# EAGLE design shield_ard (EAGLE 9.5.2)
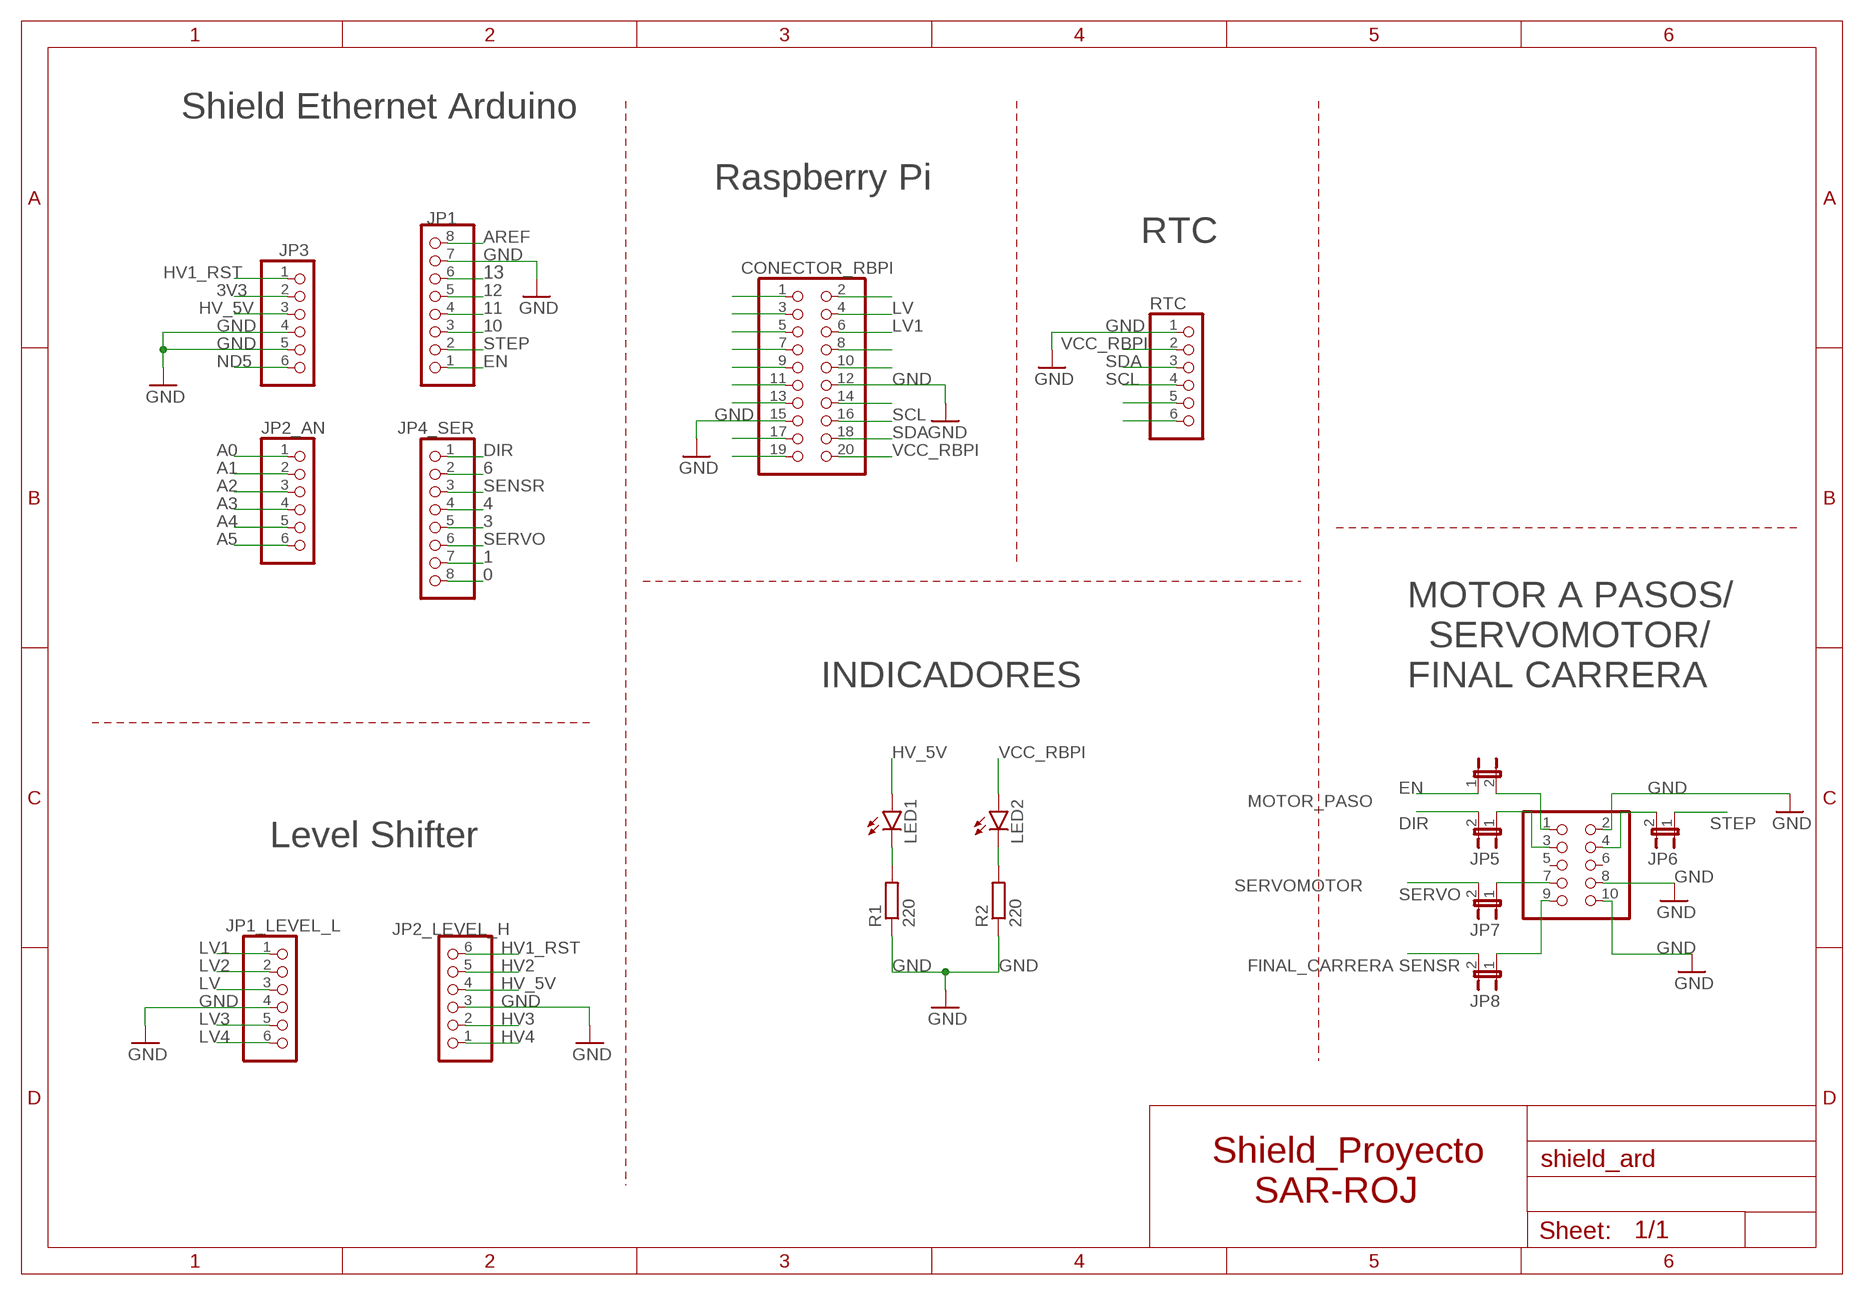
[diagram p0: schematic, sheet 1]

## Parts
CONECTOR_RBPI  PINHD-2X10  [2X10]
JP1  PINHD-1X8  [1X08]
JP1_LEVEL_L  PINHD-1X6  [1X06]
JP2  JUMPER-2PTH  [1X02]
JP2_AN  PINHD-1X6  [1X06]
JP2_LEVEL_H  PINHD-1X6  [1X06]
JP3  PINHD-1X6  [1X06]
JP4_SER  PINHD-1X8  [1X08]
JP5  JUMPER-2PTH  [1X02]
JP6  JUMPER-2PTH  [1X02]
JP7  JUMPER-2PTH  [1X02]
JP8  JUMPER-2PTH  [1X02]
LED1  LEDCHIP-LED0805  [CHIP-LED0805]
LED2  LEDCHIP-LED0805  [CHIP-LED0805]
MOTOR_PASO  PINHD-2X5  [2X05]
R1  220  R-EU_R0805  [R0805]
R2  220  R-EU_R0805  [R0805]
RTC  PINHD-1X6/90  [1X06/90]

## Nets
0: JP4_SER.8
1: JP4_SER.7
3: JP4_SER.5
3V3: JP3.2
4: JP4_SER.4
6: JP4_SER.2
10: JP1.3
11: JP1.4
12: JP1.5
13: JP1.6
A0: JP2_AN.1
A1: JP2_AN.2
A2: JP2_AN.3
A3: JP2_AN.4
A4: JP2_AN.5
A5: JP2_AN.6
AREF: JP1.8
DIR: JP4_SER.1 JP5.1 JP5.2 MOTOR_PASO.3
EN: JP1.1 JP2.1 JP2.2 MOTOR_PASO.1
GND: CONECTOR_RBPI.12 CONECTOR_RBPI.15 JP1.7 JP1_LEVEL_L.4 JP2_LEVEL_H.3 JP3.4 JP3.5 MOTOR_PASO.2 MOTOR_PASO.8 MOTOR_PASO.10 R1.1 R2.1 RTC.1
HV1_RST: JP2_LEVEL_H.6 JP3.1
HV2: JP2_LEVEL_H.5
HV3: JP2_LEVEL_H.2
HV4: JP2_LEVEL_H.1
HV_5V: JP2_LEVEL_H.4 JP3.3 LED1.A
LV: CONECTOR_RBPI.4 JP1_LEVEL_L.3
LV1: CONECTOR_RBPI.6 JP1_LEVEL_L.1
LV2: JP1_LEVEL_L.2
LV3: JP1_LEVEL_L.5
LV4: JP1_LEVEL_L.6
N$2: LED1.C R1.2
N$3: LED2.C R2.2
N$6: JP6.2 MOTOR_PASO.4
N$7: JP7.1 MOTOR_PASO.7
N$17: CONECTOR_RBPI.2
N$19: CONECTOR_RBPI.1
N$20: CONECTOR_RBPI.3
N$21: CONECTOR_RBPI.5
N$22: CONECTOR_RBPI.7
N$23: CONECTOR_RBPI.9
N$24: CONECTOR_RBPI.11
N$25: CONECTOR_RBPI.13
N$27: CONECTOR_RBPI.17
N$28: CONECTOR_RBPI.19
N$30: CONECTOR_RBPI.8
N$31: CONECTOR_RBPI.10
N$33: CONECTOR_RBPI.14
N$41: RTC.5
N$42: RTC.6
ND5: JP3.6
SCL: CONECTOR_RBPI.16 RTC.4
SDA: CONECTOR_RBPI.18 RTC.3
SENSR: JP4_SER.3 JP8.1 JP8.2 MOTOR_PASO.9
SERVO: JP4_SER.6 JP7.2
STEP: JP1.2 JP6.1
VCC_RBPI: CONECTOR_RBPI.20 LED2.A RTC.2
Unconnected: MOTOR_PASO.5 MOTOR_PASO.6

## Notes on the sheet
- Shield Ethernet Arduino
- Raspberry Pi
- RTC
- INDICADORES
- MOTOR A PASOS/
    SERVOMOTOR/ 
  FINAL CARRERA
- Level Shifter
- SERVOMOTOR
- FINAL_CARRERA
- Shield_Proyecto 
      SAR-ROJ

## Library data of the parts
CONECTOR_RBPI = pinhead:PINHD-2X10: PIN HEADER
JP1 JP4_SER = pinhead:PINHD-1X8: PIN HEADER
JP1_LEVEL_L JP2_AN JP2_LEVEL_H JP3 RTC = pinhead:PINHD-1X6: PIN HEADER
JP2 JP5-JP8 = SparkFun-Retired:JUMPER-2: Jumper Basic 0.1" spaced jumper. Use with breakaway headers.
LED1 LED2 = led:LED: LED OSRAM: - CHIPLED LG R971, LG N971, LY N971, LG Q971, LY Q971, LO R971, LY R971 LH N974, LH R974 LS Q976, LO Q976, LY Q976 LO Q996 - Hyper CHIPLED LW Q18S LB Q993, LB Q99A, LB R99A - SideLED LS A670, LO A670, LY A670, LG A670, LP A670 LB A673, LV A673, LT A673, LW A673 LH A674 LY A675 LS A676, LA A676, LO A676, LY A676, LW A676 LS A679, LY A679, LG A679 - Hyper Micro SIDELED® LS Y876, LA Y876, LO Y876, LY Y876 LT Y87S - SmartLED LW L88C, LW L88S LB L89C, LB L89S, LG L890 LS L89K, LO L89K, LY L89K LS L896, LA L896, LO L896, LY L896 - TOPLED LS T670, LO T670, LY T670, LG T670, LP T670 LSG T670, LSP T670, LSY T670, LOP T670, LYG T670 LG T671, LOG T671, LSG T671 LB T673, LV T673, LT T673, LW T673 LH T674 LS T676, LA T676, LO T676, LY T676, LB T676, LH T676, LSB T676, LW T676 LB T67C, LV T67C, LT T67C, LS T67K, LO T67K, LY T67K, LW E67C LS E67B, LA E67B, LO E67B, LY E67B, LB E67C, LV E67C, LT E67C LW T67C LS T679, LY T679, LG T679 LS T770, LO T770, LY T770, LG T770, LP T770 LB T773, LV T773, LT T773, LW T773 LH T774 LS E675, LA E675, LY E675, LS T675 LS T776, LA T776, LO T776, LY T776, LB T776 LHGB T686 LT T68C, LB T68C - Hyper Mini TOPLED® LB M676 - Mini TOPLED Santana® LG M470 LS M47K, LO M47K, LY M47K Source: http://www.osram.convergy.de LUXEON: - LUMILED® LXK2-PW12-R00, LXK2-PW12-S00, LXK2-PW14-U00, LXK2-PW14-V00 LXK2-PM12-R00, LXK2-PM12-S00, LXK2-PM14-U00 LXK2-PE12-Q00, LXK2-PE12-R00, LXK2-PE12-S00, LXK2-PE14-T00, LXK2-PE14-U00 LXK2-PB12-K00, LXK2-PB12-L00, LXK2-PB12-M00, LXK2-PB14-N00, LXK2-PB14-P00, LXK2-PB14-Q00 LXK2-PR12-L00, LXK2-PR12-M00, LXK2-PR14-Q00, LXK2-PR14-R00 LXK2-PD12-Q00, LXK2-PD12-R00, LXK2-PD12-S00 LXK2-PH12-R00, LXK2-PH12-S00 LXK2-PL12-P00, LXK2-PL12-Q00, LXK2-PL12-R00 Source: www.luxeon.com KINGBRIGHT: KA-3528ASYC Source: www.kingbright.com
MOTOR_PASO = pinhead:PINHD-2X5: PIN HEADER
R1 R2 = rcl:R-EU_: RESISTOR, European symbol; SPICEPREFIX: R

## Board
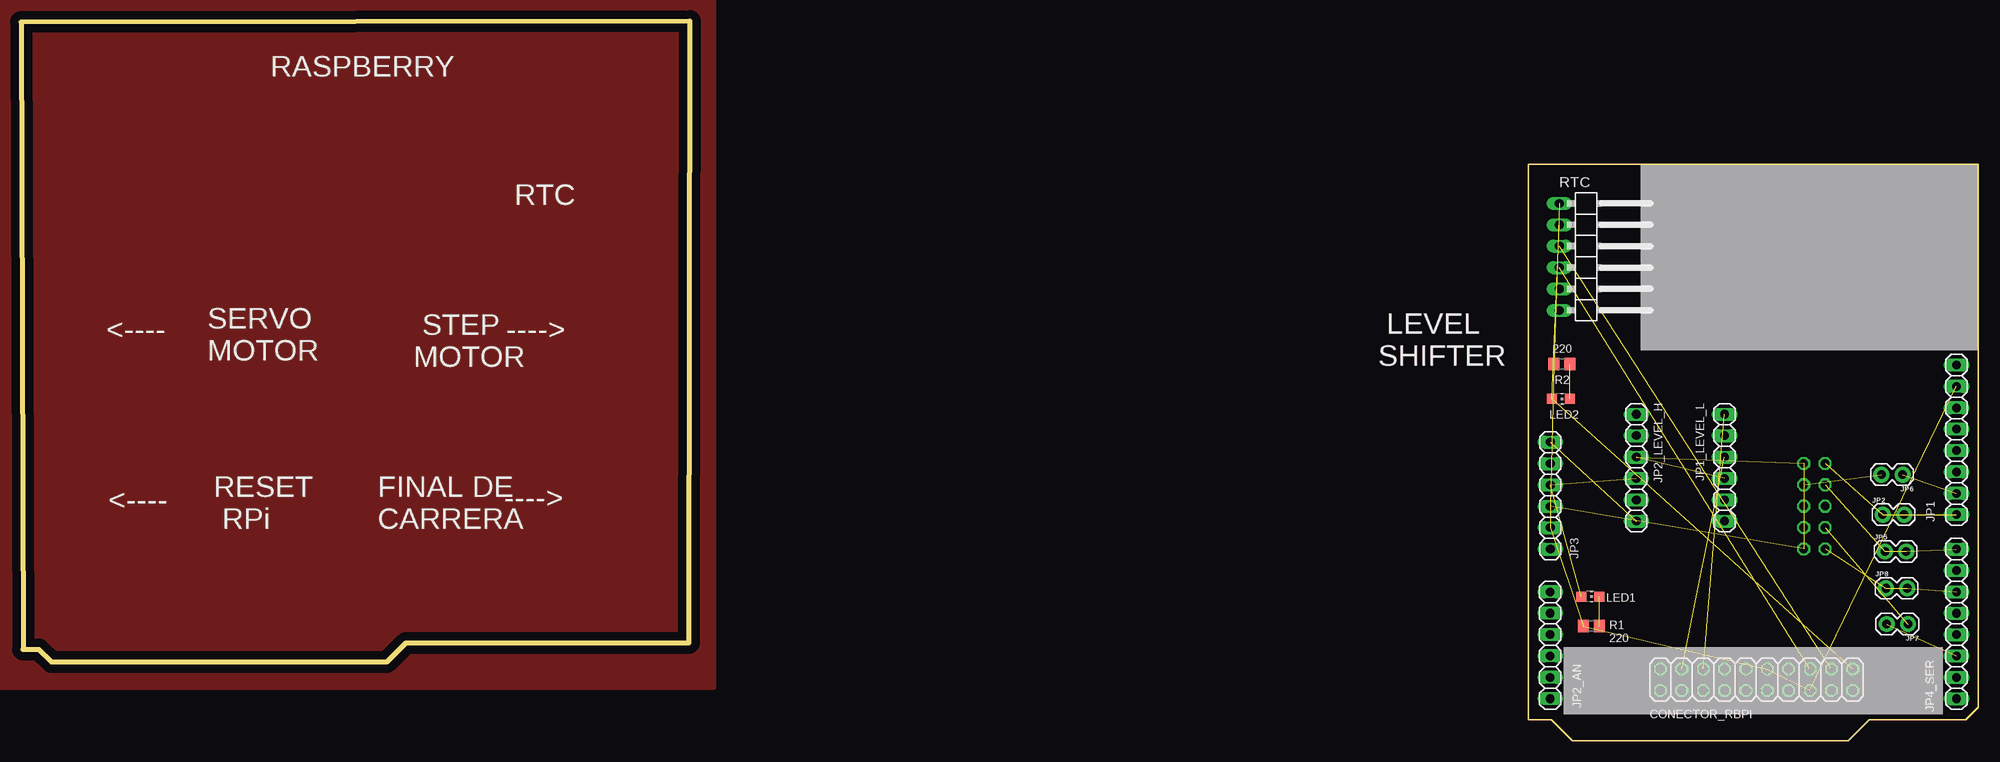
[diagram p1: board, top side]
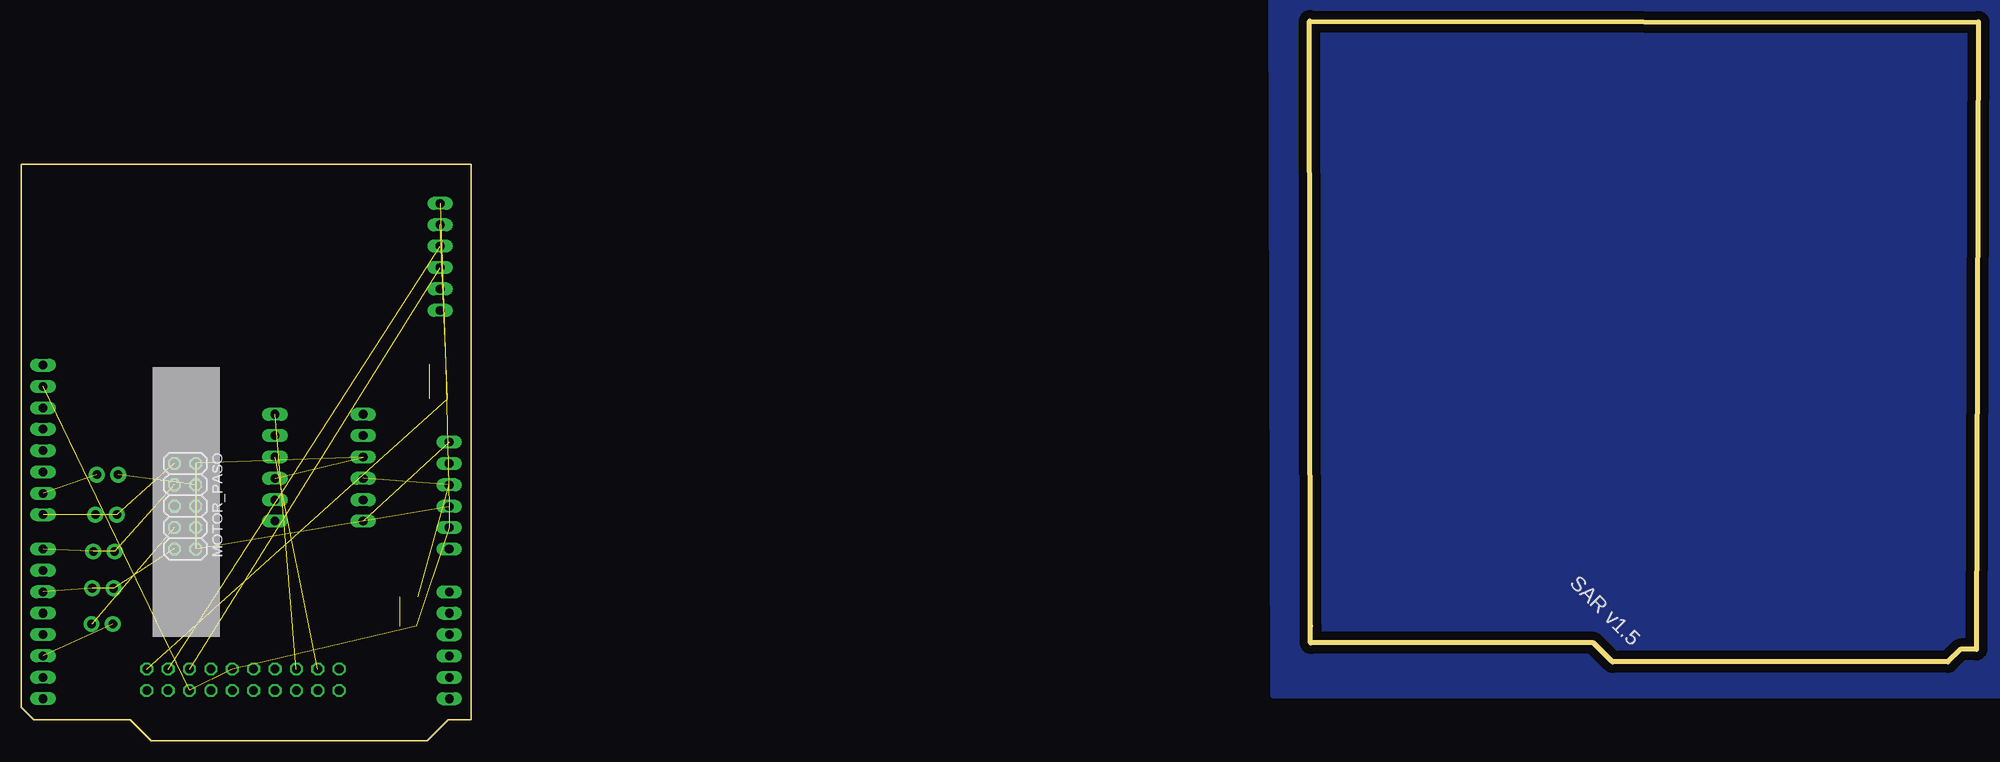
[diagram p2: board, bottom side, seen from below]

Size 232.62 x 85.52 mm. Coordinates in mm from the lower left corner, seen from the top.
Outline: 0.25,10.88 2.12,10.88 3.62,9.38 43.5,9.38 45.75,11.62 79.38,11.62 79.39,13.62 79.51,85.52 0,85.39 0.25,10.88
Outline: 179.12,2.5 181.88,2.5 184.38,0 217.12,0 219.62,2.5 231.12,2.5 232.62,4 232.62,68.5 179.12,68.5 179.12,2.5
Copper layers (1*16): Top 0.035mm / dielectric 1.5mm / Bottom 0.035mm
Design rules "default": minimum track width 6mil, minimum drill 0.35mm, track to track 6mil, track to pad 6mil, pad to pad 6mil, via to via 6mil, smd to smd 6mil, copper to edge 40mil, drill to drill 6mil, minimum pad ring 10mil, minimum via ring 8mil, stop-mask expansion 4mil, vias tented up to drill 0mil, thermal gap 10mil

### Footprints (pad centres in the part's own frame; a part is rotated, then mirrored left to right if it is on the bottom)
2X10 = drill 1.016 octagon: 1 -11.43,-1.27; 2 -11.43,1.27; 3 -8.89,-1.27; 4 -8.89,1.27; 5 -6.35,-1.27; 6 -6.35,1.27; 7 -3.81,-1.27; 8 -3.81,1.27; 9 -1.27,-1.27; 10 -1.27,1.27; 11 1.27,-1.27; 12 1.27,1.27; 13 3.81,-1.27; 14 3.81,1.27; 15 6.35,-1.27; 16 6.35,1.27; 17 8.89,-1.27; 18 8.89,1.27; 19 11.43,-1.27; 20 11.43,1.27
1X08 = drill 1.016 long: 1 -8.89,0; 2 -6.35,0; 3 -3.81,0; 4 -1.27,0; 5 1.27,0; 6 3.81,0; 7 6.35,0; 8 8.89,0
1X06 = drill 1.016 long: 1 -6.35,0; 2 -3.81,0; 3 -1.27,0; 4 1.27,0; 5 3.81,0; 6 6.35,0
1X02 = drill 1.016 pad 1.88: 1 0,0; 2 2.54,0
CHIP-LED0805 = smd 1.2 x 1.2: A 0,-1.05; C 0,1.05
2X05 = drill 1.016 octagon: 1 -5.08,-1.27; 2 -5.08,1.27; 3 -2.54,-1.27; 4 -2.54,1.27; 5 0,-1.27; 6 0,1.27; 7 2.54,-1.27; 8 2.54,1.27; 9 5.08,-1.27; 10 5.08,1.27
R0805 = smd 1.3 x 1.5: 1 -0.95,0; 2 0.95,0
1X06/90 = drill 1.016 long: 1 -6.35,-3.81; 2 -3.81,-3.81; 3 -1.27,-3.81; 4 1.27,-3.81; 5 3.81,-3.81; 6 6.35,-3.81

### Placement (x,y rotation side)
CONECTOR_RBPI  206.25,7.25 0 top
JP1  230,35.75 90 top
JP1_LEVEL_L  202.44,32.45 270 top
JP2  221.25,26.88 0 top
JP2_AN  181.74,11.35 90 top
JP2_LEVEL_H  191.97,32.45 270 top
JP3  181.75,29.12 270 top
JP4_SER  230,13.88 270 top
JP5  221.5,22.5 0 top
JP6  223.62,31.62 180 top
JP7  224.25,13.88 180 top
JP8  221.62,18.12 0 top
LED1  186.5,17.12 270 top
LED2  183,40.62 270 top
MOTOR_PASO  213.12,27.88 270 bottom
R1  186.62,13.62 0 top
R2  183.12,44.75 0 top
RTC  186.62,57.5 270 top

### Tracks (layer width: path | path; a pad name or v marks a point on that pad's centre or on a via)
DIR  (3 unrouted)
EN  (3 unrouted)
GND  (12 unrouted)
  pour Bottom (isolate 0.813): -3.88,90.12 84.13,90.12 83.88,5.38 -3.88,5.38
  pour Top (isolate 0.813): -2.62,88.38 -2.62,6.38 82.38,6.38 82.38,88.38
HV1_RST  (1 unrouted)
HV_5V  (2 unrouted)
LV  (1 unrouted)
LV1  (1 unrouted)
N$2  (1 unrouted)
N$3  (1 unrouted)
N$6  (1 unrouted)
N$7  (1 unrouted)
SCL  (1 unrouted)
SDA  (1 unrouted)
SENSR  (3 unrouted)
SERVO  (1 unrouted)
STEP  (1 unrouted)
VCC_RBPI  (2 unrouted)

### Text on the board
tPlace: RASPBERRY | RTC | <---- | ----> | SERVO / MOTOR | STEP / MOTOR | LEVEL / SHIFTER | ----> | <---- | RESET / RPi | FINAL DE / CARRERA
bPlace: SAR v1.5